# EAGLE schematic Cargador 12,6V-5A (EAGLE 7.6.0)
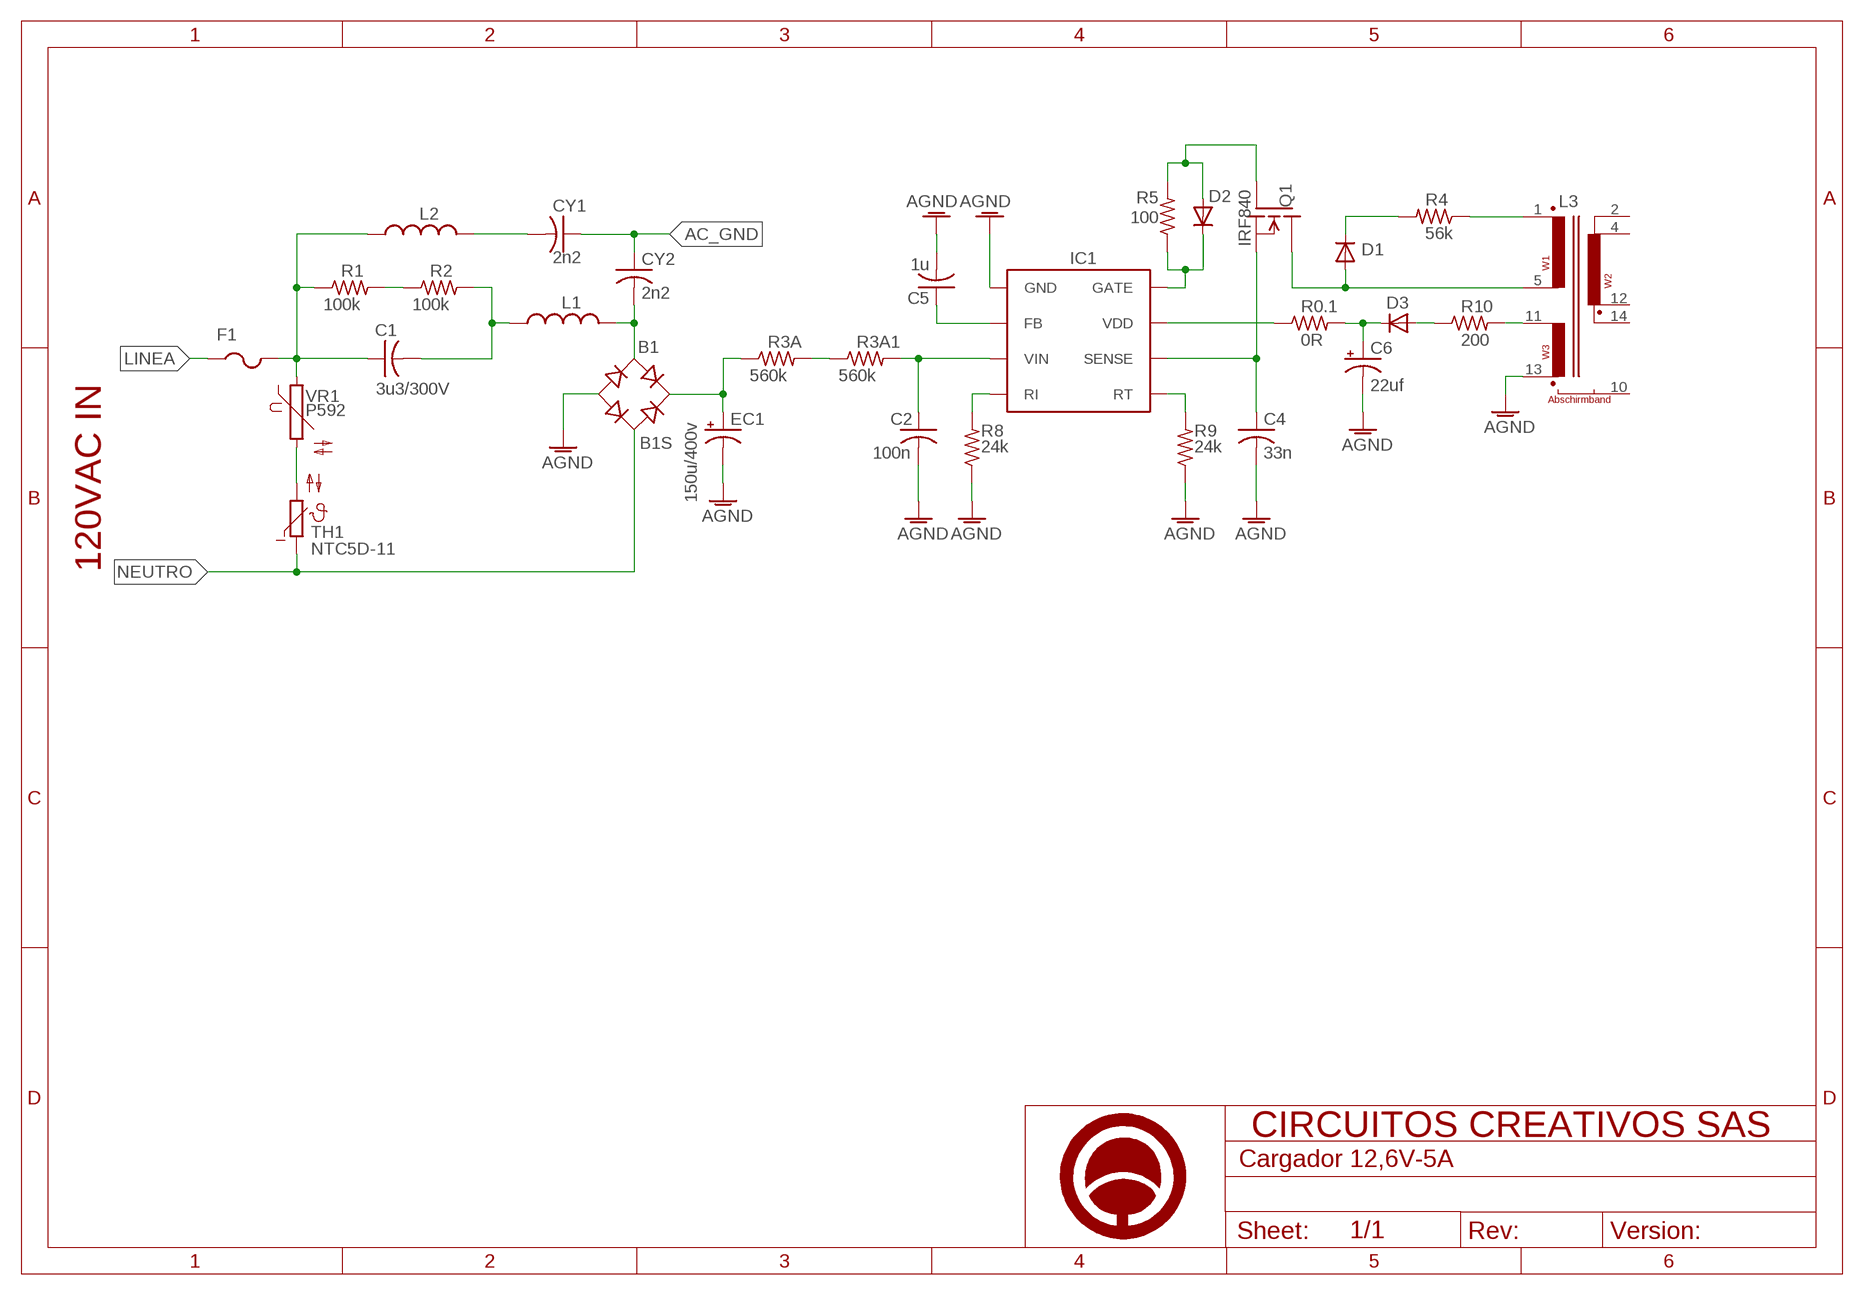
[diagram p0: schematic, sheet 1]

## Parts
B1  B1S  [MBS]
C1  3u3/300V  C-US050-024X044  [C050-024X044]
C2  100n  C-US050-024X044  [C050-024X044]
C4  33n  C-US050-024X044  [C050-024X044]
C5  1u  C-US050-024X044  [C050-024X044]
C6  22uf  CPOL-USE5-10.5  [E5-10,5]
CY1  2n2  C-US050-024X044  [C050-024X044]
CY2  2n2  C-US050-024X044  [C050-024X044]
D1  MBR0520LT  [SOD123]
D2  MBR0520LT  [SOD123]
D3  MBR0520LT  [SOD123]
EC1  150u/400v  CPOL-USE5-10.5  [E5-10,5]
F1  PTCFUSE-1812  [1812]
IC1  OB2269  [SOP-8]
L1  L-USIR-2  [IR-2]
L2  L-USIR-2  [IR-2]
L3  ST-D4  [ST-D4]
Q1  IRF840  [TO220]
R0.1  0R  R-US_0204/7  [0204/7]
R1  100k  R-US_0204/7  [0204/7]
R2  100k  R-US_0204/7  [0204/7]
R3A  560k  R-US_0204/7  [0204/7]
R3A1  560k  R-US_0204/7  [0204/7]
R4  56k  R-US_0204/7  [0204/7]
R5  100  R-US_0204/7  [0204/7]
R8  24k  R-US_0204/7  [0204/7]
R9  24k  R-US_0204/7  [0204/7]
R10  200  R-US_0204/7  [0204/7]
TH1  NTC5D-11  NTC640-9  [N640]
U$1  A4_HORIZONTAL  [LOGO]
VR1  P592  [P592]

## Nets
AC_GND: CY1.1 CY2.1
AGND: B1.- C2.2 C4.2 C5.2 C6.- EC1.- IC1.GND L3.13(3A) R8.1 R9.1
LINEA: F1.1
N$1: C1.1 F1.2 L2.1 R1.1 VR1.1
N$2: TH1.2 VR1.2
N$3: R1.2 R2.1
N$4: C1.2 L1.1 R2.2
N$5: B1.AC1 CY2.2 L1.2
N$6: CY1.2 L2.2
N$7: R3A1.1 R3A.2
N$8: B1.+ EC1.+ R3A.1
N$9: C2.1 IC1.VIN R3A1.2
N$10: C5.1 IC1.FB
N$11: IC1.VDD R0.1.1
N$12: C6.+ D3.C R0.1.2
N$13: D3.A R10.1
N$14: L3.11(3E) R10.2
N$15: IC1.RI R8.2
N$16: IC1.RT R9.2
N$17: C4.1 IC1.SENSE Q1.3(S)
N$18: D2.C IC1.GATE R5.1
N$19: L3.1(1A) R4.1
N$20: D2.A Q1.1(G) R5.2
N$21: D1.A L3.5(1E) Q1.2(D)
N$22: D1.C R4.2
NEUTRO: B1.AC2 TH1.1
Unconnected: L3.2(2E) L3.4(2E1) L3.10(SCH) L3.12(2A) L3.14(2A1)

## Notes on the sheet
- 120VAC IN

## Library data of the parts
B1 = rectifier:B*S: Surface Mount Glass Passivated Bridge Rectifiers Source: Comchip Bridge Rectifiers B05S-G_B10S-G.pdf
C1 C2 C4 C5 CY1 CY2 = rcl:C-US: CAPACITOR, American symbol
C6 EC1 = rcl:CPOL-US: POLARIZED CAPACITOR, American symbol
D1-D3 = diode:MBR0520LT: SCHOTTKY BARRIER RECTIFIER Source: http://onsemi.com .. MBR0520LT1-D.pdf
F1 = adafruit:PTCFUSE: PTC fuses, resettable thermistors
IC1 = Circuitos-Creativos-Integrados-8pin:OB2269: Controlador de corritente por PWM
L1 L2 = rcl:L-US: INDUCTOR, American symbol
L3 = trafo-siemens:ST-D4: TRANSFORMER; OC_FARNELL: unknown; OC_NEWARK: unknown
Q1 = transistor-fet:IRF840: N-Channel Enhancement MOSFET (HEXFET); 500V; 8A; 0,85Ohm
R0.1 R1 R2 R3A R3A1 R4 R5 R8-R10 = rcl:R-US_: RESISTOR, American symbol
TH1 = ptc-ntc:NTC640-9: PHILIPS NTC; OC_FARNELL: unknown; OC_NEWARK: unknown
U$1 = Circuitos-Creativos-Estilos:A4_HORIZONTAL
VR1 = varistor:P592: VARISTOR